# Altium schematic sheet 1010829PA_HVFlyback_GD_Testboard_PowerStage.SchDoc: Flyback
size A4; CompanyName: drivetek ag; DrawnBy: NLE; Address1: industriestrasse 37; Address2: 2555 brügg; Address3: Switzerland; SheetNumber: 2; SheetTotal: 2
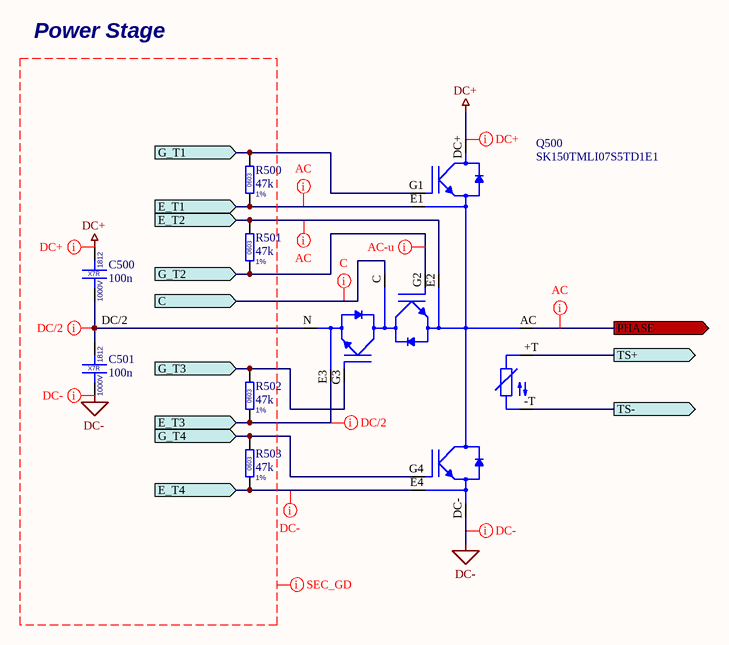
[diagram p0: 1010829PA_HVFlyback_GD_Testboard_PowerStage.SchDoc]

## Parts
C500  100n  Voltage: 1000V  CaseName: 1812  Type3: X7R  [02_1812_DRK_1-65mm]
C501  100n  Voltage: 1000V  CaseName: 1812  Type3: X7R  [02_1812_DRK_1-65mm]
Q500  SK150TMLI07S5TD1E1  [03_SK150TMLI07S5TD1E1]  (no BOM)
R500  47k  Tolerance: 1%  CaseName: 0603  [01_0603_DRK_1-7x1-0x0-55]
R501  47k  Tolerance: 1%  CaseName: 0603  [01_0603_DRK_1-7x1-0x0-55]
R502  47k  Tolerance: 1%  CaseName: 0603  [01_0603_DRK_1-7x1-0x0-55]
R503  47k  Tolerance: 1%  CaseName: 0603  [01_0603_DRK_1-7x1-0x0-55]

## Ports
C (in), E_T1 (in), E_T2 (in), E_T3 (in), E_T4 (in), G_T1 (in), G_T2 (in), G_T3 (in), G_T4 (in), PHASE (out), TS+ (out), TS- (out)

## Nets
DC+: C500.1 Q500.DC+
DC-: C501.2 Q500.DC-
C: Q500.C ; port C
DC/2: C500.2 C501.1 Q500.N
E_T1: Q500.E1 R500.2 ; port E_T1
E_T2: Q500.E2 R501.1 ; port E_T2
E_T3: Q500.E3 R502.2 ; port E_T3
E_T4: Q500.E4 R503.2 ; port E_T4
G_T1: Q500.G1 R500.1 ; port G_T1
G_T2: Q500.G2 R501.2 ; port G_T2
G_T3: Q500.G3 R502.1 ; port G_T3
G_T4: Q500.G4 R503.1 ; port G_T4
PHASE: Q500.AC ; port PHASE
TS+: Q500.+T ; port TS+
TS-: Q500.-T ; port TS-

## Layout directives
net class DC+: DC+
net class DC/2: DC/2, E_T3
net class DC-: DC-, E_T4
net class AC: E_T1, E_T2, PHASE
net class C: C
net class SEC_GD: DC+, DC-, DC/2
net class AC-u: G_T2

## Notes on the sheet
- Power Stage
- Assembly Variant:
- Sheet
- Size:
- of
- A4
- File:
- Released:
- |
- Drawn:

## Library data of the parts
C500 C501 = 02-0279: Part Description: Ceramic 1812 100n 1000VDC X7R flexiterm; Manufacturer 1: Kemet; Manufacturer Part Number 1: C1812X104KDRACTU; LatestRevision Note: Initial; Type1: CAP; Type2: Ceramic; Tolerance: 10; Order Number: 80-C1812X104KDRACTU; Part Number: 02-0279; Author: RLE; PartValue: 100n; ROHS: True; ComponentLink1Description: Datasheet; ComponentLink1URL: http://www.kemet.com/kemet/web/homepage/kechome.nsf/file/KEM_C1034_X7R_HV_ARC_SMD/$file/KEM_C1034_X7R_HV_ARC_SMD.pdf; LatestRevision Date: 04.07.2012; Distributor: Mouser; Price: 0.92
Q500 = 03-0421: Part Description: Single phase TNPC, 650V, 150A, mit NTC, Preliminary; Manufacturer 1: Semikron; LatestRevision Note: Initial; Type1: MODULE; Type2: Power; Voltage: 650V; Current: 150A; Part Number: 03-0421; Author: NLE; PartValue: SK150TMLI07S5TD1E1; CaseName: SEMITOP E1; ROHS: False; ComponentLink1Description: Datasheet; LatestRevision Date: 13.11.2017; Manufacturer Part Number 1: SK150TMLI07S5TD1E1; Distributor: Semikron; Price: 0; ComponentLink1URL: K:\Volkswagen\1779_LE_BZ_Luftversorgung\03_Hardware\Datenblätter VW ELV\Modul\OFF-17-0180.01_VW_SEMITOPE1_technical information 24.08.17.pdf; Order Number: SK150TMLI07S5TD1E1
R500-R503 = 01-0088: Part Description: 0603 47k 50V 0.063W 1%; Manufacturer 1: Multicomp; Manufacturer Part Number 1: MC 0.063W 0603 1% 47K; LatestRevision Note: Checked; Type1: RES; Type2: Thickfilm; Voltage: 50V; Power: 63m; Checked: CBA; Order Number: 9331255; Part Number: 01-0088; Author: CBA; PartValue: 47k; ROHS: True; ComponentLink1Description: Datasheet; ComponentLink1URL: http://www.farnell.com/datasheets/90824.pdf; LatestRevision Date: 06.10.2006; Distributor: Farnell; Price: 0.06